# Altium schematic sheet SchV2-4cap.SchDoc
size A3
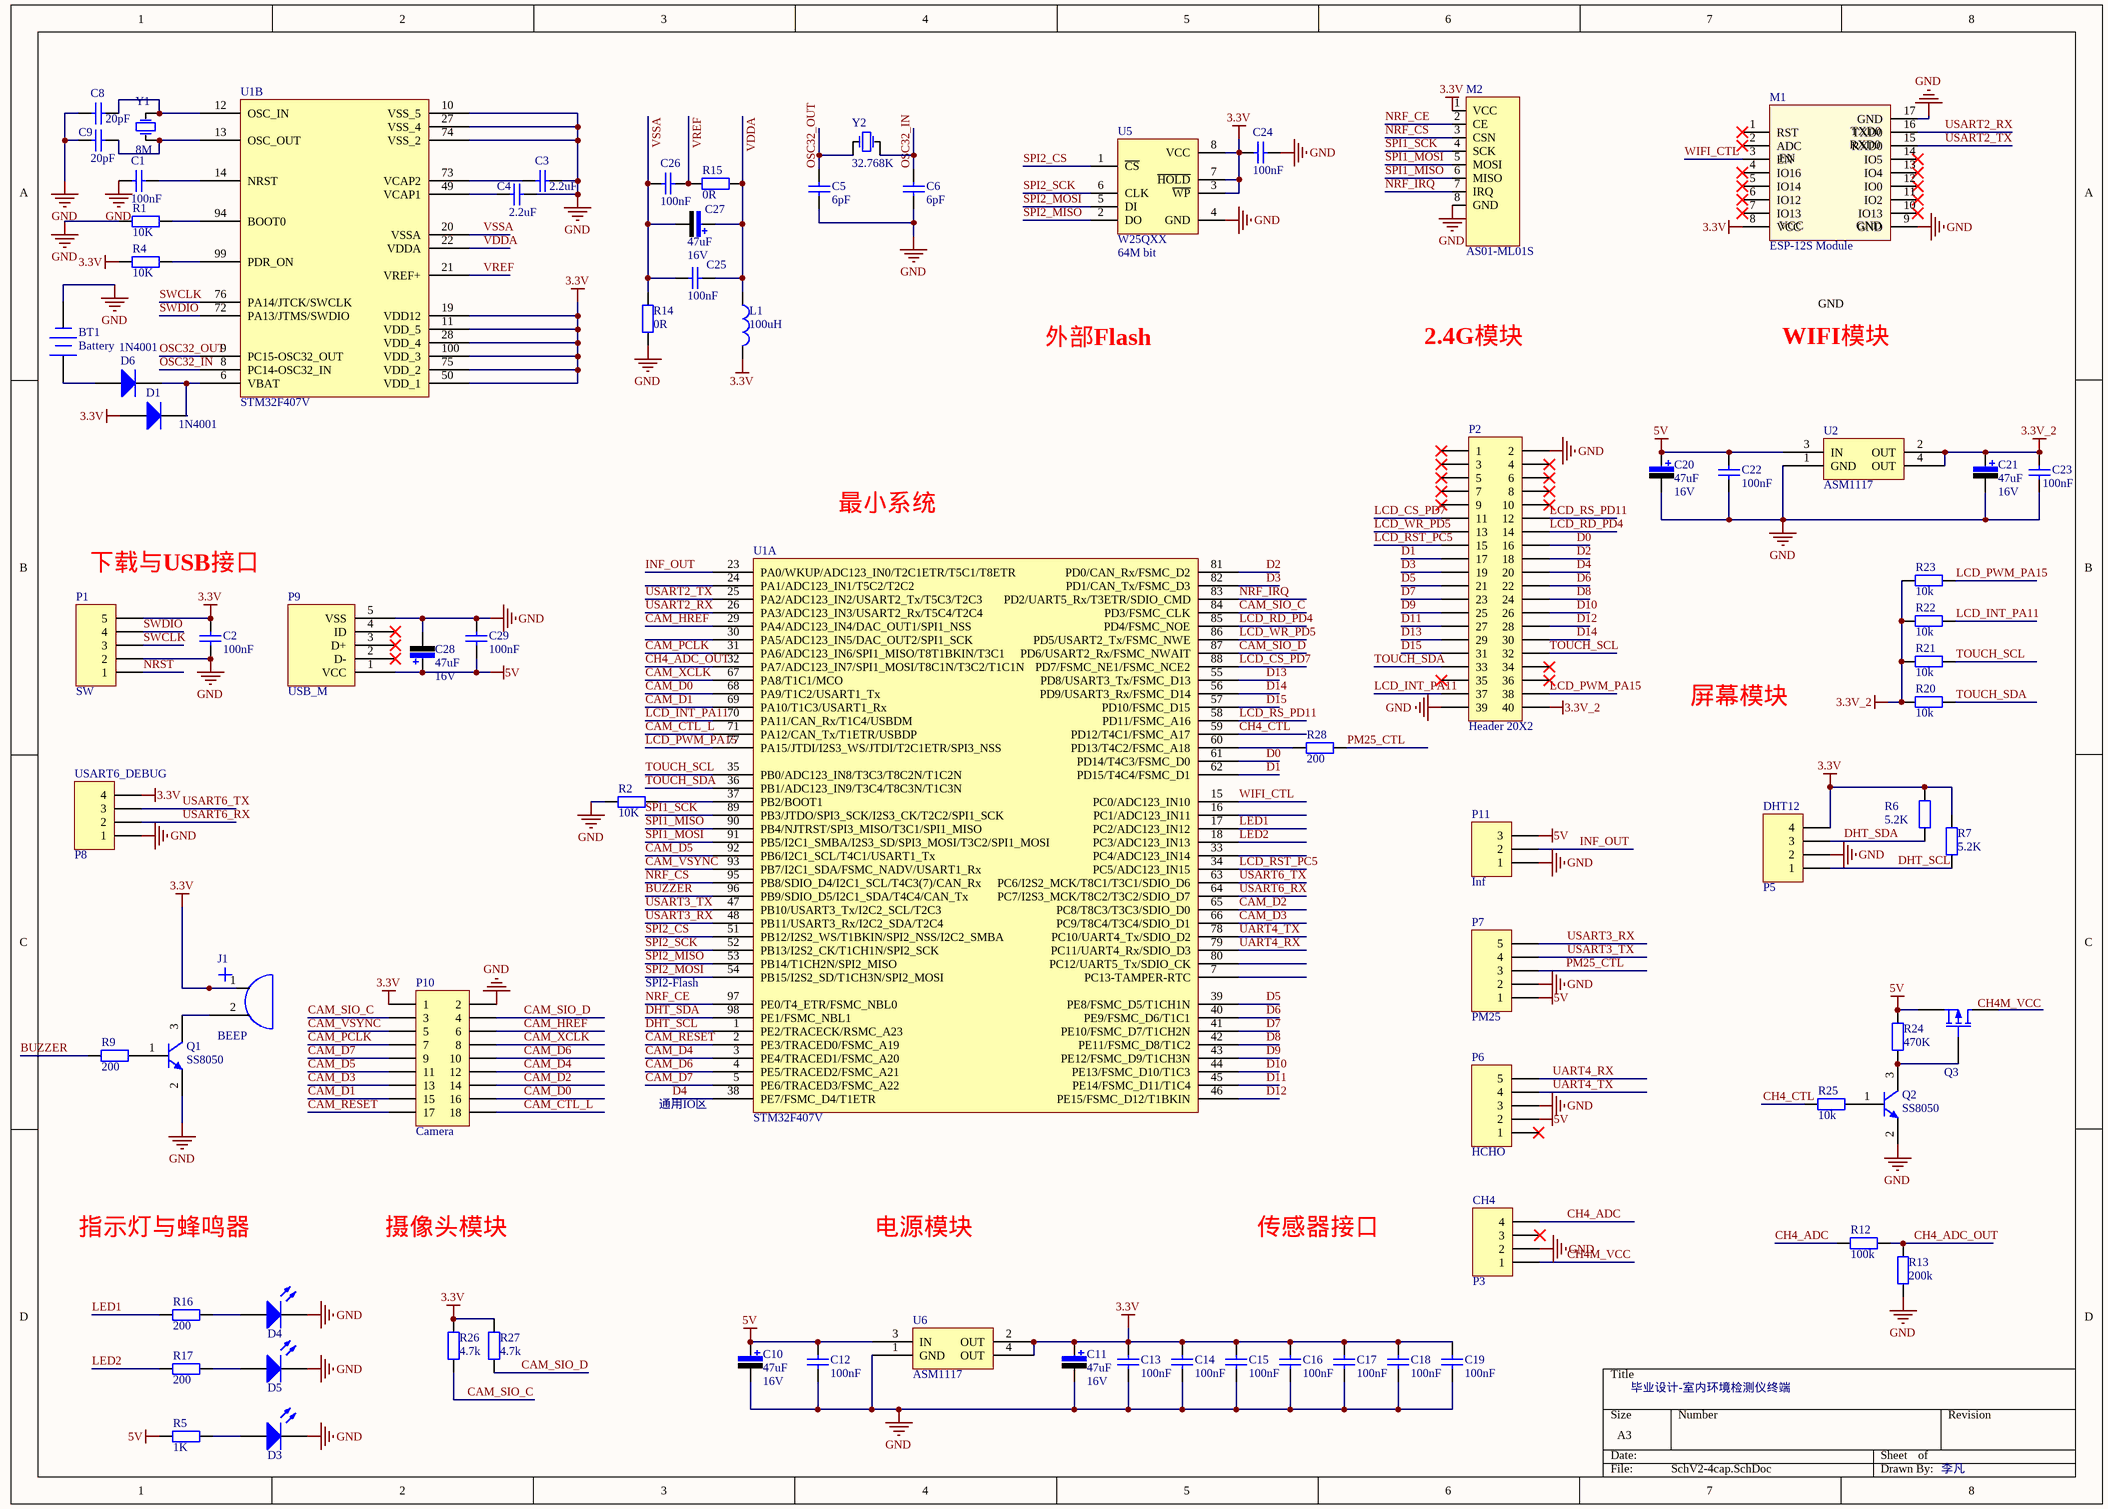
[diagram p0: SchV2-4cap.SchDoc]

## Parts
BT1  Battery  [CR1220]
C1  value 100nF  [C-RAD-0603]  (hidden comment: Cap)
C2  value 100nF  [C-RAD-0603]  (hidden comment: Cap)
C3  value 2.2uF  [C-RAD-0603]  (hidden comment: Cap)
C4  value 2.2uF  [C-RAD-0603]  (hidden comment: Cap)
C5  value 6pF  [C-RAD-0603]  (hidden comment: Cap)
C6  value 6pF  [C-RAD-0603]  (hidden comment: Cap)
C8  value 20pF  [C-RAD-0603]  (hidden comment: Cap)
C9  value 20pF  [C-RAD-0603]  (hidden comment: Cap)
C10  value 47uF  Vol: 16V  [CAP-3528]  (hidden comment: Cap Pol)
C11  value 47uF  Vol: 16V  [CAP-3528]  (hidden comment: Cap Pol)
C12  value 100nF  [C-RAD-0603]  (hidden comment: Cap)
C13  value 100nF  [C-RAD-0603]  (hidden comment: Cap)
C14  value 100nF  [C-RAD-0603]  (hidden comment: Cap)
C15  value 100nF  [C-RAD-0603]  (hidden comment: Cap)
C16  value 100nF  [C-RAD-0603]  (hidden comment: Cap)
C17  value 100nF  [C-RAD-0603]  (hidden comment: Cap)
C18  value 100nF  [C-RAD-0603]  (hidden comment: Cap)
C19  value 100nF  [C-RAD-0603]  (hidden comment: Cap)
C20  value 47uF  Vol: 16V  [CAP-3528]  (hidden comment: Cap Pol)
C21  value 47uF  Vol: 16V  [CAP-3528]  (hidden comment: Cap Pol)
C22  value 100nF  [C-RAD-0603]  (hidden comment: Cap)
C23  value 100nF  [C-RAD-0603]  (hidden comment: Cap)
C24  value 100nF  [C-RAD-0603]  (hidden comment: Cap)
C25  value 100nF  [C-RAD-0603]  (hidden comment: Cap)
C26  value 100nF  [C-RAD-0603]  (hidden comment: Cap)
C27  value 47uF  Vol: 16V  [CAP-3528]  (hidden comment: Cap Pol)
C28  value 47uF  Vol: 16V  [CAP-3528]  (hidden comment: Cap Pol)
C29  value 100nF  [C-RAD-0603]  (hidden comment: Cap)
D1  Type: 1N4001  [DIODE-1206]  (hidden comment: Diode)
D3  LED0  [LED_0805]  (value not drawn)
D4  LED0  [LED_0805]  (value not drawn)
D5  LED0  [LED_0805]  (value not drawn)
D6  Type: 1N4001  [DIODE-1206]  (hidden comment: Diode)
J1  BEEP  [Beep]
L1  value 100uH  [0805-1]  (hidden comment: Inductor)
M1  ESP-12S Module  [ESP-12S Module]
M2  AS01-ML01S  [AS01-ML01S]
P1  SW  [7-Header_7mm]
P2  Header 20X2  [HDR2X20]
P3  CH4  [HDR4X1_A]
P5  DHT12  [HDR4X1_A]
P6  HCHO  [7-Header_7mm]
P7  PM25  [7-Header_7mm]
P8  USART6_DEBUG  [HDR4X1_A]
P9  USB_M  [USB_MICRO]
P10  Camera  [HDR2X9]
P11  Inf  [HDR1X3]
Q1  SS8050  [SOT-23]
Q2  SS8050  [SOT-23]
Q3  MOSFET-P  [TO-220AB]  (value not drawn)
R1  value 10K  [0603-1]  (hidden comment: Res1)
R2  value 10K  [0603-1]  (hidden comment: Res1)
R4  value 10K  [0603-1]  (hidden comment: Res1)
R5  value 1K  [0603-1]  (hidden comment: Res1)
R6  value 5.2K  [0603-1]  (hidden comment: Res1)
R7  value 5.2K  [0603-1]  (hidden comment: Res1)
R9  value 200  [0603-1]  (hidden comment: Res1)
R12  value 100k  [0603-1]  (hidden comment: Res1)
R13  value 200k  [0603-1]  (hidden comment: Res1)
R14  value 0R  [0603-1]  (hidden comment: Res1)
R15  value 0R  [0603-1]  (hidden comment: Res1)
R16  value 200  [0603-1]  (hidden comment: Res1)
R17  value 200  [0603-1]  (hidden comment: Res1)
R20  value 10k  [0603-1]  (hidden comment: Res1)
R21  value 10k  [0603-1]  (hidden comment: Res1)
R22  value 10k  [0603-1]  (hidden comment: Res1)
R23  value 10k  [0603-1]  (hidden comment: Res1)
R24  value 470K  [0603-1]  (hidden comment: Res1)
R25  value 10k  [0603-1]  (hidden comment: Res1)
R26  value 4.7k  [0603-1]  (hidden comment: Res1)
R27  value 4.7k  [0603-1]  (hidden comment: Res1)
R28  value 200  [0603-1]  (hidden comment: Res1)
U1  STM32F407V  [LQFP-100_M]  (parts A,B of 2)
U2  ASM1117  [SOT-223]
U5  W25QXX  Memory: 64M bit  [SOIC8_W]
U6  ASM1117  [SOT-223]
Y1  value 8M  [X-SM49]  (hidden comment: XTAL)
Y2  value 32.768K  [MC-306]  (hidden comment: XTAL)

## Nets
3.3V: C2.2 C11.1 C13.2 C14.2 C15.2 C16.2 C17.2 C18.2 C19.2 C24.2 D1.1(A) J1.1 L1.2 M1.8(VCC) M2.1(VCC) P1.5 P5.4 P8.4 P10.1 R4.1 R6.2 R7.2 R26.2 R27.1 U1.11(VDD_5) U1.19(VDD12) U1.28(VDD_4) U1.50(VDD_1) U1.75(VDD_2) U1.100(VDD_3) U5.3(~{WP}) U5.7(~{HOLD}) U5.8(VCC) U6.2(OUT) U6.4(OUT)
3.3V_2: C21.1 C23.2 P2.40 R20.2 R21.2 R22.2 R23.2 U2.2(OUT) U2.4(OUT)
5V: C10.1 C12.2 C20.1 C22.2 C28.1 C29.2 P6.2 P7.1 P9.1(VCC) P11.3 Q3.S R5.2 R24.2 U2.3(IN) U6.3(IN)
GND: BT1.2(-) C1.2 C2.1 C3.2 C4.2 C5.1 C6.1 C8.1 C9.1 C10.2 C11.2 C12.1 C13.1 C14.1 C15.1 C16.1 C17.1 C18.1 C19.1 C20.2 C21.2 C22.1 C23.1 C24.1 C28.2 C29.1 D3.2(K) D4.2(K) D5.2(K) M1.9(GND) M1.17(GND) M2.8(GND) P1.2 P2.2 P2.39 P3.2 P5.2 P6.3 P7.2 P8.1 P9.5(VSS) P10.2 P11.1 Q1.2(E) Q2.2(E) R1.1 R2.1 R13.1 R14.1 U1.10(VSS_5) U1.27(VSS_4) U1.74(VSS_2) U2.1(GND) U5.4(GND) U6.1(GND)
BUZZER: R9.2 U1.96(PB9/SDIO_D5/I2C1_SDA/T4C4/CAN_Tx)
CAM_CTL_L: P10.18 U1.71(PA12/CAN_Tx/T1ETR/USBDP)
CAM_D0: P10.16 U1.68(PA9/T1C2/USART1_Tx)
CAM_D1: P10.15 U1.69(PA10/T1C3/USART1_Rx)
CAM_D2: P10.14 U1.65(PC8/T8C3/T3C3/SDIO_D0)
CAM_D3: P10.13 U1.66(PC9/T8C4/T3C4/SDIO_D1)
CAM_D4: P10.12 U1.3(PE4/TRACED1/FSMC_A20)
CAM_D5: P10.11 U1.92(PB6/I2C1_SCL/T4C1/USART1_Tx)
CAM_D6: P10.10 U1.4(PE5/TRACED2/FSMC_A21)
CAM_D7: P10.9 U1.5(PE6/TRACED3/FSMC_A22)
CAM_HREF: P10.6 U1.29(PA4/ADC123_IN4/DAC_OUT1/SPI1_NSS)
CAM_PCLK: P10.7 U1.31(PA6/ADC123_IN6/SPI1_MISO/T8T1BKIN/T3C1)
CAM_RESET: P10.17 U1.2(PE3/TRACED0/FSMC_A19)
CAM_SIO_C: P10.3 R26.1 U1.84(PD3/FSMC_CLK)
CAM_SIO_D: P10.4 R27.2 U1.87(PD6/USART2_Rx/FSMC_NWAIT)
CAM_VSYNC: P10.5 U1.93(PB7/I2C1_SDA/FSMC_NADV/USART1_Rx)
CAM_XCLK: P10.8 U1.67(PA8/T1C1/MCO)
CH4_ADC: P3.4 R12.1
CH4_ADC_OUT: R12.2 R13.2 U1.32(PA7/ADC123_IN7/SPI1_MOSI/T8C1N/T3C2/T1C1N)
CH4_CTL: R25.2 U1.59(PD12/T4C1/FSMC_A17)
CH4M_VCC: P3.1
D0: P2.16 U1.61(PD14/T4C3/FSMC_D0)
D1: P2.17 U1.62(PD15/T4C4/FSMC_D1)
D2: P2.18 U1.81(PD0/CAN_Rx/FSMC_D2)
D3: P2.19 U1.82(PD1/CAN_Tx/FSMC_D3)
D4: P2.20 U1.38(PE7/FSMC_D4/T1ETR)
D5: P2.21 U1.39(PE8/FSMC_D5/T1CH1N)
D6: P2.22 U1.40(PE9/FSMC_D6/T1C1)
D7: P2.23 U1.41(PE10/FSMC_D7/T1CH2N)
D8: P2.24 U1.42(PE11/FSMC_D8/T1C2)
D9: P2.25 U1.43(PE12/FSMC_D9/T1CH3N)
D10: P2.26 U1.44(PE13/FSMC_D10/T1C3)
D11: P2.27 U1.45(PE14/FSMC_D11/T1C4)
D12: P2.28 U1.46(PE15/FSMC_D12/T1BKIN)
D13: P2.29 U1.55(PD8/USART3_Tx/FSMC_D13)
D14: P2.30 U1.56(PD9/USART3_Rx/FSMC_D14)
D15: P2.31 U1.57(PD10/FSMC_D15)
DHT_SCL: P5.1 R7.1 U1.1(PE2/TRACECK/RSMC_A23)
DHT_SDA: P5.3 R6.1 U1.98(PE1/FSMC_NBL1)
INF_OUT: P11.2 U1.23(PA0/WKUP/ADC123_IN0/T2C1ETR/T5C1/T8ETR)
LCD_CS_PD7: P2.11 U1.88(PD7/FSMC_NE1/FSMC_NCE2)
LCD_INT_PA11: P2.37 R22.1 U1.70(PA11/CAN_Rx/T1C4/USBDM)
LCD_PWM_PA15: P2.38 R23.1 U1.77(PA15/JTDI/I2S3_WS/JTDI/T2C1ETR/SPI3_NSS)
LCD_RD_PD4: P2.14 U1.85(PD4/FSMC_NOE)
LCD_RS_PD11: P2.12 U1.58(PD11/FSMC_A16)
LCD_RST_PC5: P2.15 U1.34(PC5/ADC123_IN15)
LCD_WR_PD5: P2.13 U1.86(PD5/USART2_Tx/FSMC_NWE)
LED1: R16.2 U1.17(PC2/ADC123_IN12)
LED2: R17.2 U1.18(PC3/ADC123_IN13)
NRF_CE: M2.2(CE) U1.97(PE0/T4_ETR/FSMC_NBL0)
NRF_CS: M2.3(CSN) U1.95(PB8/SDIO_D4/I2C1_SCL/T4C3(7)/CAN_Rx)
NRF_IRQ: M2.7(IRQ) U1.83(PD2/UART5_Rx/T3ETR/SDIO_CMD)
NRST: P1.1
OSC32_IN: C6.2 U1.8(PC14-OSC32_IN) Y2.2(OSC2)
OSC32_OUT: C5.2 U1.9(PC15-OSC32_OUT) Y2.1(OSC1)
PM25_CTL: P7.3 R28.2
SPI1_MISO: M2.6(MISO) U1.90(PB4/NJTRST/SPI3_MISO/T3C1/SPI1_MISO)
SPI1_MOSI: M2.5(MOSI) U1.91(PB5/I2C1_SMBA/I2S3_SD/SPI3_MOSI/T3C2/SPI1_MOSI)
SPI1_SCK: M2.4(SCK) U1.89(PB3/JTDO/SPI3_SCK/I2S3_CK/T2C2/SPI1_SCK)
SPI2_CS: U1.51(PB12/I2S2_WS/T1BKIN/SPI2_NSS/I2C2_SMBA) U5.1(~{CS})
SPI2_MISO: U1.53(PB14/T1CH2N/SPI2_MISO) U5.2(DO)
SPI2_MOSI: U1.54(PB15/I2S2_SD/T1CH3N/SPI2_MOSI) U5.5(DI)
SPI2_SCK: U1.52(PB13/I2S2_CK/T1CH1N/SPI2_SCK) U5.6(CLK)
SWCLK: P1.3 U1.76(PA14/JTCK/SWCLK)
SWDIO: P1.4 U1.72(PA13/JTMS/SWDIO)
TOUCH_SCL: P2.32 R21.1 U1.35(PB0/ADC123_IN8/T3C3/T8C2N/T1C2N)
TOUCH_SDA: P2.33 R20.1 U1.36(PB1/ADC123_IN9/T3C4/T8C3N/T1C3N)
UART4_RX: P6.5 U1.79(PC11/UART4_Rx/SDIO_D3)
UART4_TX: P6.4 U1.78(PC10/UART4_Tx/SDIO_D2)
USART2_RX: M1.16(TXD0) U1.26(PA3/ADC123_IN3/USART2_Rx/T5C4/T2C4)
USART2_TX: M1.15(RXD0) U1.25(PA2/ADC123_IN2/USART2_Tx/T5C3/T2C3)
USART3_RX: P7.5 U1.48(PB11/USART3_Rx/I2C2_SDA/T2C4)
USART3_TX: P7.4 U1.47(PB10/USART3_Tx/I2C2_SCL/T2C3)
USART6_RX: P8.2 U1.64(PC7/I2S3_MCK/T8C2/T3C2/SDIO_D7)
USART6_TX: P8.3 U1.63(PC6/I2S2_MCK/T8C1/T3C1/SDIO_D6)
VDDA: C25.1 C27.1 L1.1 R15.1 U1.22(VDDA)
VREF: C26.1 R15.2 U1.21(VREF+)
VSSA: C25.2 C26.2 C27.2 R14.2 U1.20(VSSA)
WIFI_CTL: M1.3(EN) U1.15(PC0/ADC123_IN10)
NetBT1_1: BT1.1(+) D6.1(A)
NetC1_1: C1.1 U1.14(NRST)
NetC3_1: C3.1 U1.73(VCAP2)
NetC4_1: C4.1 U1.49(VCAP1)
NetC8_2: C8.2 U1.12(OSC_IN) Y1.2(OSC2)
NetC9_2: C9.2 U1.13(OSC_OUT) Y1.1(OSC1)
NetD1_2: D1.2(K) D6.2(K) U1.6(VBAT)
NetD3_1: D3.1(A) R5.1
NetD4_1: D4.1(A) R16.1
NetD5_1: D5.1(A) R17.1
NetJ1_2: J1.2 Q1.3(C)
NetQ1_1: Q1.1(B) R9.1
NetQ2_3: Q2.3(C) Q3.G R24.1
NetR1_2: R1.2 U1.94(BOOT0)
NetR2_2: R2.2 U1.37(PB2/BOOT1)
NetR4_2: R4.2 U1.99(PDR_ON)
NetR28_1: R28.1 U1.60(PD13/T4C2/FSMC_A18)

Not connected (* = marked no-connect by the designer): M1 1(RST)* 2(ADC)* 4(IO16)* 5(IO14)* 6(IO12)* 7(IO13)* 10(IO13)* 11(IO2)* 12(IO0)* 13(IO4)* 14(IO5)*; P2 1* 3* 4* 5* 6* 7* 8* 9* 10* 34* 35* 36*; P3 3*; P6 1*; P9 2(D-)* 3(D+)* 4(ID)*; Q2 1(B); Q3 D; R25 1; U1 7(PC13-TAMPER-RTC) 16(PC1/ADC123_IN11) 24(PA1/ADC123_IN1/T5C2/T2C2) 30(PA5/ADC123_IN5/DAC_OUT2/SPI1_SCK) 33(PC4/ADC123_IN14) 80(PC12/UART5_Tx/SDIO_CK)

## Notes on the sheet
- (near M1) EN
- (near M1) RXD0
- (near M1) TXD0
- (near M1) VCC
- (near M1) GND
- GND
- 外部Flash
- 2.4G模块
- WIFI模块
- 最小系统
- 下载与USB接口
- 屏幕模块
- (near U1) SPI2-Flash
- 通用IO区
- 指示灯与蜂鸣器
- 摄像头模块
- 电源模块
- 传感器接口
- 毕业设计-室内环境检测仪终端
- 李凡
- Labels drawn without touching a wire or pin: CH4M_VCC

## Library data of the parts
BT1 = Battery: 备份电池; Published: 24-Mar-1999; LatestRevisionDate: 17-Jul-2002; LatestRevisionNote: Re-released for DXP Platform.; PackageReference: BAT-2; Publisher: Altium Limited
C1-C6 C8 C9 C12-C19 C22-C26 C29 = Cap: 无极性电容; Published: 8-Jun-2000; LatestRevisionDate: 17-Jul-2002; LatestRevisionNote: Re-released for DXP Platform.; PackageReference: RAD-0.3; Publisher: Altium Limited
C10 C11 C20 C21 C27 C28 = Cap Pol: 极性电解电容; Published: 8-Jun-2000; LatestRevisionDate: 17-Jul-2002; LatestRevisionNote: Re-released for DXP Platform.; PackageReference: RB7.6-15; Publisher: Altium Limited
D1 D6 = Diode: 二极管; Published: 8-Jun-2000; LatestRevisionDate: 17-Jul-2002; LatestRevisionNote: Re-released for DXP Platform.; PackageDocument: Sep-1996; PackageReference: SMC; Publisher: Altium Limited; Code_JEDEC: DO-214-AB
D3-D5 = LED0: 发光二极管; Published: 8-Jun-2000; LatestRevisionDate: 08-Jul-2005; LatestRevisionNote: Mech Layer 1 removed.; PackageReference: LED-0; Publisher: Altium Limited
J1 = BEEP: 蜂鸣器
L1 = Inductor: 电感; Code_IEC: 1005; Published: 8-Jun-2000; LatestRevisionDate: 17-Jul-2002; LatestRevisionNote: Re-released for DXP Platform.; PackageReference: 0402-A; Publisher: Altium Limited; Code_JEITA: 0402
M2 = AS01-ML01S: 贴片2.4G模块
P1 P6 P7 = Header 5: Header, 5-Pin; LatestRevisionDate: 17-Jul-2002; LatestRevisionNote: Re-released for DXP Platform.; Publisher: Altium Limited
P2 = Header 20X2: Header, 20-Pin, Dual row; LatestRevisionDate: 17-Jul-2002; LatestRevisionNote: Re-released for DXP Platform.; Publisher: Altium Limited
P3 P5 P8 = Header 4: 接插件; LatestRevisionDate: 17-Jul-2002; LatestRevisionNote: Re-released for DXP Platform.; Publisher: Altium Limited
P9 = USB_M: MicroUSB接口
P10 = Header 9X2: Header, 9-Pin, Dual row; LatestRevisionDate: 17-Jul-2002; LatestRevisionNote: Re-released for DXP Platform.; Publisher: Altium Limited
P11 = Header 3: Header, 3-Pin; LatestRevisionDate: 17-Jul-2002; LatestRevisionNote: Re-released for DXP Platform.; Publisher: Altium Limited
Q1 Q2 = SS8050: NPN贴片三极管; Published: 8-Jun-2000; LatestRevisionDate: 15-Jan-2003; LatestRevisionNote: PCB Footprint 'BCY-W3/D4.7' replaced; DatasheetDocument: 1997; PackageDocument: Sep-1998; PackageReference: TO-92A; Publisher: Altium Limited; Code_JEDEC: TO-92A; ComponentLink1Description: Manufacturer Link; ComponentLink1URL: http://www.fairchildsemi.com/; ComponentLink2Description: Datasheet; ComponentLink2URL: http://www.fairchildsemi.com/ds/2N%2F2N3904.pdf
Q3 = MOSFET-P: P-Channel MOSFET; PackageDocument: 1995/1996; Published: 8-Jun-2000; LatestRevisionDate: 17-Jul-2002; LatestRevisionNote: Re-released for DXP Platform.; PackageReference: E3; Publisher: Altium Limited
R1 R2 R4-R7 R9 R12-R17 R20-R28 = Res1: 贴片电阻; Published: 8-Jun-2000; LatestRevisionDate: 17-Jul-2002; LatestRevisionNote: Re-released for DXP Platform.; PackageReference: AXIAL-0.4; Publisher: Altium Limited
U1 = STM32F407V: STM32单片机100引脚
U2 U6 = ASM1117: 3.3V稳压芯片
U5 = W25QXX: SPI FLASH
Y1 = XTAL: 晶振; Published: 8-Jun-2000; LatestRevisionDate: 17-Jul-2002; LatestRevisionNote: Re-released for DXP Platform.; PackageReference: R38; Publisher: Altium Limited
Y2 = XTAL: 晶振; pin to pad: 2>4; Published: 8-Jun-2000; LatestRevisionDate: 17-Jul-2002; LatestRevisionNote: Re-released for DXP Platform.; PackageReference: R38; Publisher: Altium Limited